# Altium schematic sheet OPAmp Supply.SchDoc
size A4; SPICEModelCachePZZAGAGG: <root> / <DocumentId>PZZAGAGG</DocumentId> / <CacheFrame Number="0"> / <Model Name="2510_74438323010_1u" Kind="CKT"> / <Text>******* / .subckt 2510_74438323010_1u 1 2 / Rp 1 2 2155.33 / Cp 1 2 3.992p / Rs 1 N3 0.063 / L1 N3 2 1.01u / .ends 2510_74438323010_1u</Text> / </Model> / <Model Name="1610_74438313022_2.2u" Kind="CKT"> / <Text>******* / .subckt 1610_74438313022_2.2u 1 2 / Rp 1 2 5651.21 / Cp 1 2 2.5307p / Rs 1 N3 0.337 / L1 N3 2 2.27u / .ends 1610_74438313022_2.2u</Text> / </Model> / </CacheFrame> / </root>
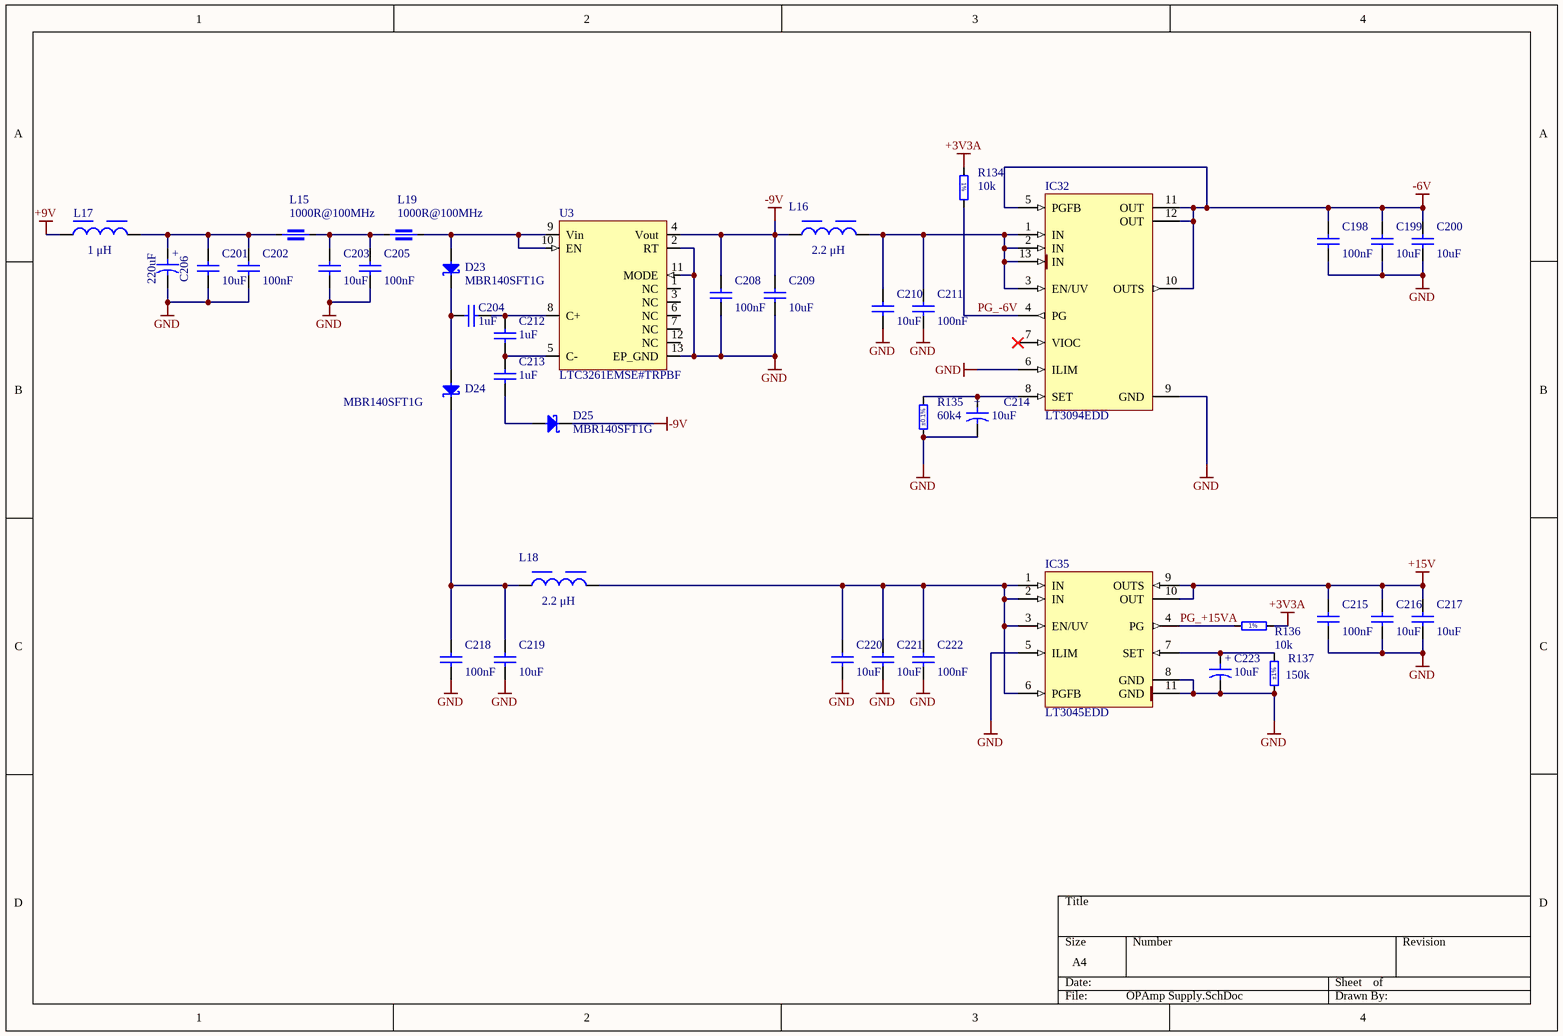
[diagram p0: OPAmp Supply.SchDoc]

## Parts
C198  100nF  [CAPC1005X55N]
C199  10uF  [CAPC2012X145N]
C200  10uF  [CAPC2012X145N]
C201  10uF  [CAPC2012X145N]
C202  100nF  [CAPC1005X55N]
C203  10uF  [CAPC2012X145N]
C204  1uF  [CAPC1608X87N]
C205  100nF  [CAPC1005X55N]
C206  220uF  [CAPMP7343X430N]
C208  100nF  [CAPC1005X55N]
C209  10uF  [CAPC2012X145N]
C210  10uF  [CAPC2012X145N]
C211  100nF  [CAPC1005X55N]
C212  1uF  [CAPC1608X87N]
C213  1uF  [CAPC1608X87N]
C214  10uF  [CAPMP6032X280N]
C215  100nF  [CAPC1005X55N]
C216  10uF  [CAPC2012X145N]
C217  10uF  [CAPC2012X145N]
C218  100nF  [CAPC1005X55N]
C219  10uF  [CAPC2012X145N]
C220  10uF  [CAPC2012X145N]
C221  10uF  [CAPC2012X145N]
C222  100nF  [CAPC1005X55N]
C223  10uF  [CAPMP6032X280N]
D23  MBR140SFT1G  [SOD-123FL]
D24  MBR140SFT1G  [SOD-123FL]
D25  MBR140SFT1G  [SOD-123FL]
IC32  LT3094EDD  [SON45P300X300X80-13N-R175X248]
IC35  LT3045EDD  [SON50P300X300X80-11N-R175X248]
L15  1000R@100MHz  [INDC1608X95N]
L16  2.2 μH  [WE-MAPI_1610]
L17  1 μH  [WE-MAPI_2510]
L18  2.2 μH  [WE-MAPI_1610]
L19  1000R@100MHz  [INDC1608X95N]
R134  10k  [RESC1005X40N]
R135  60k4  Tolerance: ±0.1%  [RESC1608X55N]
R136  10k  [RESC1005X40N]
R137  150k  Tolerance: ±1%  [RESC1608X55N]
U3  LTC3261EMSE#TRPBF  [TSSOP-12]

## Nets
+3V3A: R134.2 R136.2
+9V: L17.1
+15V: C215.1 C216.2 C217.2 IC35.9(OUTS) IC35.10(OUT)
-6V: C198.1 C199.2 C200.2 IC32.5(PGFB) IC32.10(OUTS) IC32.11(OUT) IC32.12(OUT)
-9V: C208.1 C209.2 D25.1(C) L16.1 U3.4(Vout)
GND: C198.2 C199.1 C200.1 C201.1 C202.2 C203.1 C205.2 C206.2 C208.2 C209.1 C210.1 C211.2 C214.2 C215.2 C216.1 C217.1 C218.2 C219.1 C220.1 C221.1 C222.2 C223.2 IC32.6(ILIM) IC32.9(GND) IC35.5(ILIM) IC35.8(GND) IC35.11(GND) R135.1 R137.1 U3.2(RT) U3.11(MODE) U3.13(EP_GND)
PG_+15VA: IC35.4(PG) R136.1
PG_-6V: IC32.4(PG) R134.1
NetC201_2: C201.2 C202.1 C206.1 L15.1 L17.2
NetC203_2: C203.2 C205.1 L15.2 L19.1
NetC204_1: C204.1 C212.2 U3.8(C+)
NetC204_2: C204.2 D23.1(C) D24.2(A)
NetC210_2: C210.2 C211.1 IC32.1(IN) IC32.2(IN) IC32.3(EN/UV) IC32.13(IN) L16.2
NetC212_1: C212.1 C213.2 U3.5(C-)
NetC213_1: C213.1 D25.2(A)
NetC214_1: C214.1 IC32.8(SET) R135.2
NetC218_1: C218.1 C219.2 D24.1(C) L18.1
NetC220_2: C220.2 C221.2 C222.1 IC35.1(IN) IC35.2(IN) IC35.3(EN/UV) IC35.6(PGFB) L18.2
NetC223_1: C223.1 IC35.7(SET) R137.2
NetD23_2: D23.2(A) L19.2 U3.9(Vin) U3.10(EN)

Not connected (* = marked no-connect by the designer): IC32 7(VIOC)*; U3 1(NC) 3(NC) 6(NC) 7(NC) 12(NC)

## Notes on the sheet
- (in symbol CTE6032-28_10UF_25V_10%_LESR0500) +
- (in symbol CTE7343-43_220UF_16V_10%) +
- (in symbol R0402_10K_1%_0.0625W_100PPM) 1%

## Library data of the parts
C198 C202 C205 C208 C211 C215 C218 C222 = CC0402_100NF_16V_10%_X5R: Non-polarised capacitor; Part Description: SMD Multilayer Chip Ceramic Capacitor; Manufacturer: GENERIC; Manufacturer1 Part Number: GRM155R61C104KA88D; Voltage: 16V; TC: X5R; Tolerance: ±10%; Table: Capacitors SMD; Part Number: CC0402_100NF_16V_10%_X5R; Component Kind: Standard; Component Type: Standard; Pin Count: 2; Value: 100nF; Status: None; Manufacturer Part Number: CC0402_100NF_16V_10%_X5R; Case: 0402; Mounted: Yes; Socket: No; SMD: Yes; Manufacturer1 Example: MURATA; Manufacturer1 ComponentHeight: 0.55mm; HelpURL: \\cern.ch\dfs\Applications\Altium\Datasheets\CC0402_X5R_MURATA_GRM.pdf; Author: CERN DEM JLC; CreateDate: 2013-12-10; LatestRevisionDate: 2013-12-10
C199-C201 C203 C209 C210 C216 C217 C219-C221 = CC0805_10UF_25V_10%_X7R: Non-polarised capacitor; Part Description: SMD Multilayer Chip Ceramic Capacitor; Manufacturer: GENERIC; Manufacturer1 Part Number: GRM21BZ71E106KE15; Voltage: 25V; TC: X7R; Tolerance: ±10%; Part Number: CC0805_10UF_25V_10%_X7R; Component Kind: Standard; Component Type: Standard; Pin Count: 2; Value: 10uF; Status: Preferred; Manufacturer Part Number: CC0805_10UF_25V_10%_X7R; Case: 0805; Mounted: Yes; Socket: No; SMD: Yes; Sense: No; Manufacturer1 Example: MURATA; Manufacturer1 ComponentHeight: 1.45mm; HelpURL: \\cern.ch\dfs\Applications\Altium\Datasheets\CC0805_MURATA_GRM21BZ71E106KE15.pdf; Author: CERN DEM HF; CreateDate: 16.05.2023; LatestRevisionDate: 16.05.2023
C204 C212 C213 = CC0603_1UF_25V_10%_X7R: Non-polarised capacitor; Part Description: SMD Multilayer Chip Ceramic Capacitor; Manufacturer: GENERIC; Manufacturer1 Part Number: GRM188R71E105KA12D; Voltage: 25V; TC: X7R; Tolerance: ±10%; Part Number: CC0603_1UF_25V_10%_X7R; Component Kind: Standard; Component Type: Standard; Pin Count: 2; Value: 1uF; Status: None; Manufacturer Part Number: CC0603_1UF_25V_10%_X7R; Case: 0603; Mounted: Yes; Socket: No; SMD: Yes; Sense: No; Manufacturer1 Example: MURATA; Manufacturer1 ComponentHeight: 0.9mm; HelpURL: \\cern.ch\dfs\Applications\Altium\Datasheets\CC0603_X7R_MURATA.pdf; Author: CERN DEM JLC; CreateDate: 18.01.2011; LatestRevisionDate: 18.01.2011
C206 = CTE7343-43_220UF_16V_10%: Polarised capacitor; Part Description: Solid Tantalum Chip Capacitor; Manufacturer: GENERIC; Manufacturer1 Part Number: TAJE227K016R; Voltage: 16V; Tolerance: ±10%; Part Number: CTE7343-43_220UF_16V_10%; Component Kind: Standard; Component Type: Standard; Pin Count: 2; Value: 220uF; Status: Preferred; Manufacturer Part Number: CTE7343-43_220UF_16V_10%; Case: E; Mounted: Yes; Socket: No; SMD: Yes; Sense: No; Manufacturer1 Example: AVX; Manufacturer1 ComponentHeight: 4.3mm; HelpURL: \\cern.ch\dfs\Applications\Altium\Datasheets\CTE_AVX_TAJ.pdf; Author: CERN DEM JLC; CreateDate: 03.12.2007; LatestRevisionDate: 03.12.2007
C214 C223 = CTE6032-28_10UF_25V_10%_LESR0500: Polarised capacitor; Part Description: Low ESR 0R5 Solid Tantalum Chip Capacitor; Manufacturer: GENERIC; Manufacturer1 Part Number: TPSC106K025R0500; Voltage: 25V; Tolerance: ±10%; Part Number: CTE6032-28_10UF_25V_10%_LESR0500; Component Kind: Standard; Component Type: Standard; Pin Count: 2; Value: 10uF; Status: Preferred; Manufacturer Part Number: CTE6032-28_10UF_25V_10%_LESR0500; Case: C; Mounted: Yes; Socket: No; SMD: Yes; Sense: No; Manufacturer1 Example: AVX; Manufacturer1 ComponentHeight: 2.8mm; HelpURL: \\cern.ch\dfs\Applications\Altium\Datasheets\CTE-LESR_AVX_TPS.pdf; Author: CERN DEM JLC; CreateDate: 05.05.2008; LatestRevisionDate: 20.01.2009
D23-D25 = MBR140SFT1G: Schottky Diode; Part Description: Schottky Power Rectifier; Manufacturer: ON SEMICONDUCTOR; Voltage: 40V; Power: 1A; PressFit: No; Bonding: No; Part Number: MBR140SFT1G; Component Kind: Standard; Component Type: Standard; Device: MBR140SFT1G; PackageDescription: Small Outline Diode Flat Lead (SOD-123FL), Body; 2.70mm L X 1.65mm W X 1.0mm H; Manufacturer Part Number: MBR140SF; Pin Count: 2; Case: SOD-123FL; Mounted: Yes; Socket: No; SMD: Yes; Sense: No; ComponentHeight: 1.0mm; HelpURL: \\cern.ch\dfs\Applications\Altium\Datasheets\MBR140SFT1G.pdf; Author: CERN DEM JLC; CreateDate: 06.04.2009; LatestRevisionDate: 24.05.2022
IC32 = LT3094EDD#PBF: -20V, 500mA, Ultralow Noise, Ultrahigh PSRR Negative Linear Regulator; Manufacturer: LINEAR TECHNOLOGY; PressFit: No; Bonding: No; Part Number: LT3094EDD#PBF; Component Kind: Standard; Component Type: Standard; Device: LT3094EDD; PackageDescription: SON, 0.45mm Pitch; 12 Pin, 3.00mm W X 3.00mm L X 0.80mm H body (w/Thermal Tab 1.75 X 2.48mm), IPC Medium Density; Part Description: -20V, 500mA, Ultralow Noise, Ultrahigh PSRR Negative Linear Regulator; Manufacturer Part Number: LT3094EDD; Pin Count: 13; Case: SON12; Mounted: Yes; Socket: No; SMD: Yes; Sense: No; ComponentHeight: 0.8mm; HelpURL: \\cern.ch\dfs\Applications\Altium\Datasheets\LT3094EDD#PBF.pdf; Author: CERN DEM JLC; CreateDate: 12.11.2018; LatestRevisionDate: 03.02.2022
IC35 = LT3045EDD#PBF: 20V, 500mA, Ultralow Noise, Ultrahigh PSRR Linear Regulator; Manufacturer: LINEAR TECHNOLOGY; PressFit: No; Bonding: No; Part Number: LT3045EDD#PBF; Component Kind: Standard; Component Type: Standard; Device: LT3045EDD; PackageDescription: SON, 0.50mm Pitch; 10 Pin, 3.00mm W X 3.00mm L X 0.80mm H body (w/Thermal Tab 1.75 X 2.48 mm), IPC Medium Density; Part Description: 20V, 500mA, Ultralow Noise, Ultrahigh PSRR Linear Regulator; Manufacturer Part Number: LT3045EDD; Pin Count: 11; Case: SON10; Mounted: Yes; Socket: No; SMD: Yes; Sense: No; ComponentHeight: 0.8mm; HelpURL: \\cern.ch\dfs\Applications\Altium\Datasheets\LT3045EDD#PBF.pdf; Author: CERN DEM JLC; CreateDate: 07.12.2016; LatestRevisionDate: 03.02.2022
L15 L19 = IND0603_MURATA_BLM18KG102SN1: Part Description: SMD Chip Ferrite Bead, Automotive; Manufacturer: MURATA; Manufacturer Part Number: BLM18KG102WH1; Power: 1A; Resistance: 0.2R; Tolerance: ±25%; Part Number: IND0603_MURATA_BLM18KG102SN1; Component Kind: Standard; Component Type: Standard; Pin Count: 2; Value: 1000R@100MHz; Case: 0603; Mounted: Yes; Socket: No; SMD: Yes; Sense: No; ComponentHeight: 0.95mm; HelpURL: \\cern.ch\dfs\Applications\Altium\Datasheets\IND0603_MURATA_BLM18KG102SN1.pdf; Author: CERN DEM HF; CreateDate: 15.12.2022; LatestRevisionDate: 15.12.2022
L16 L18 = 74438313022: WE-MAPI SMT Power Inductor, size 1610, 2.2 μH, 1.25 A, 337 mΩ; Manufacturer: Wurth Elektronik; Case/Size Code: 1610; DC Resistance: 337 mΩ; Operating Voltage (DC): 80 V; Performance Rated Current: 1.25 A; Saturation Current @ 30%: 3.25 A; Self Resonant Frequency: 70 MHz; Manufacturer Part Number: 74438313022; Category: Power Inductors; Match Code: WE-MAPI; ComponentLink1Description: Website Link; ComponentLink1URL: https://www.we-online.com/redexpert/article/74438313022?ad; ComponentLink2Description: Datasheet Link; ComponentLink2URL: https://www.we-online.com/redexpert/spec/74438313022?ad; Mount: Surface Mount; Min Operating Temperature: -40 °C; Max Operating Temperature: 125 °C; Packaging: Tape and Reel; Length: 1.6 mm; Width: 1.6 mm; Height: 1 mm; Inductance: 2.2 μH
L17 = 74438323010: WE-MAPI SMT Power Inductor, size 2510, 1 μH, 3.55 A, 63 mΩ; Manufacturer: Wurth Elektronik; Case/Size Code: 2510; DC Resistance: 63 mΩ; Operating Voltage (DC): 80 V; Performance Rated Current: 3.55 A; Saturation Current @ 30%: 5.3 A; Self Resonant Frequency: 80 MHz; Manufacturer Part Number: 74438323010; Category: Power Inductors; Match Code: WE-MAPI; ComponentLink1Description: Website Link; ComponentLink1URL: https://www.we-online.com/redexpert/article/74438323010?ad; ComponentLink2Description: Datasheet Link; ComponentLink2URL: https://www.we-online.com/redexpert/spec/74438323010?ad; Mount: Surface Mount; Min Operating Temperature: -40 °C; Max Operating Temperature: 125 °C; Packaging: Tape and Reel; Length: 2.5 mm; Width: 2 mm; Height: 1 mm; Inductance: 1 μH
R134 R136 = R0402_10K_1%_0.0625W_100PPM: Resistor - 1%; Part Description: General Purpose Thick Film Chip Resistor; Manufacturer: GENERIC; Manufacturer1 Part Number: 232270671003L; TC: ±100ppm/°C; PressFit: No; Part Number: R0402_10K_1%_0.0625W_100PPM; Component Kind: Standard; Component Type: Standard; Pin Count: 2; Value: 10k; Status: Not Recommended; Power: 0.0625W; Tolerance: ±1%; Manufacturer Part Number: R0402_10K_1%_0.0625W_100PPM; Case: 0402; Mounted: Yes; Sense: No; Socket: No; SMD: Yes; Manufacturer1 Example: YAGEO PHYCOMP; Manufacturer1 ComponentHeight: 0.4mm; HelpURL: \\cern.ch\dfs\Applications\Altium\Datasheets\R0402_Phycomp_RC0402.pdf; Author: CERN DEM JLC; CreateDate: 03/12/2007; LatestRevisionDate: 17/10/2012
R135 = R0603_60K4_0.1%_0.063W_10PPM: Resistor - 0.1%; Part Description: Thin Film Chip Resistor; Manufacturer: GENERIC; Manufacturer1 Part Number: RN73C1J60K4BTDF; Power: 0.063W; TC: ±10ppm; PressFit: No; Part Number: R0603_60K4_0.1%_0.063W_10PPM; Component Kind: Standard; Component Type: Standard; Pin Count: 2; Value: 60k4; Status: Not Recommended; Manufacturer Part Number: R0603_60K4_0.1%_0.063W_10PPM; Case: 0603; Mounted: Yes; Sense: No; Socket: No; SMD: Yes; Manufacturer1 Example: TYCO HOLSWORTHY; Manufacturer1 ComponentHeight: 0.5mm; HelpURL: \\cern.ch\dfs\Applications\Altium\Datasheets\R0603_Tyco_RN73.pdf; Author: CERN DEM JLC; CreateDate: 03.12.2007; LatestRevisionDate: 13.03.2008
R137 = R0603_150K_1%_0.1W_100PPM: Resistor - 1%; Part Description: General Purpose Thick Film Chip Resistor; Manufacturer: GENERIC; Manufacturer1 Part Number: NRC06F1503TRF; Power: 0.1W; TC: ±100ppm/°C; PressFit: No; Part Number: R0603_150K_1%_0.1W_100PPM; Component Kind: Standard; Component Type: Standard; Pin Count: 2; Value: 150k; Status: Preferred; Manufacturer Part Number: R0603_150K_1%_0.1W_100PPM; Case: 0603; Mounted: Yes; Sense: No; Socket: No; SMD: Yes; Manufacturer1 Example: NIC COMPONENT; Manufacturer1 ComponentHeight: 0.55mm; HelpURL: \\cern.ch\dfs\Applications\Altium\Datasheets\R0603_NIC_NRC.pdf; Author: CERN DEM JLC; CreateDate: 03.12.2007; LatestRevisionDate: 13.03.2008
U3 = LTC3261EMSE#TRPBF: Charge Pump Switching Regulator IC Positive or Negative Fixed -Vin, Vin/2 1 Output 100mA 12-TSSOP (0.118", 3.00mm Width) Exposed Pad; Manufacture: Analog Devices; Assembly: SMD; Shop1: Digi-Key; Shop1ID: LTC3261EMSE#TRPBFTR-ND; ComponentLink1Description: Datasheet; ComponentLink1URL: https://www.analog.com/media/en/technical-documentation/data-sheets/3261fb.pdf; ComponentSymbol: LTC3261EMSE#TRPBF; ComponentType: IC; DafaultFootprint: TSSOP-12